# EAGLE design maido_board (EAGLE 6.4)
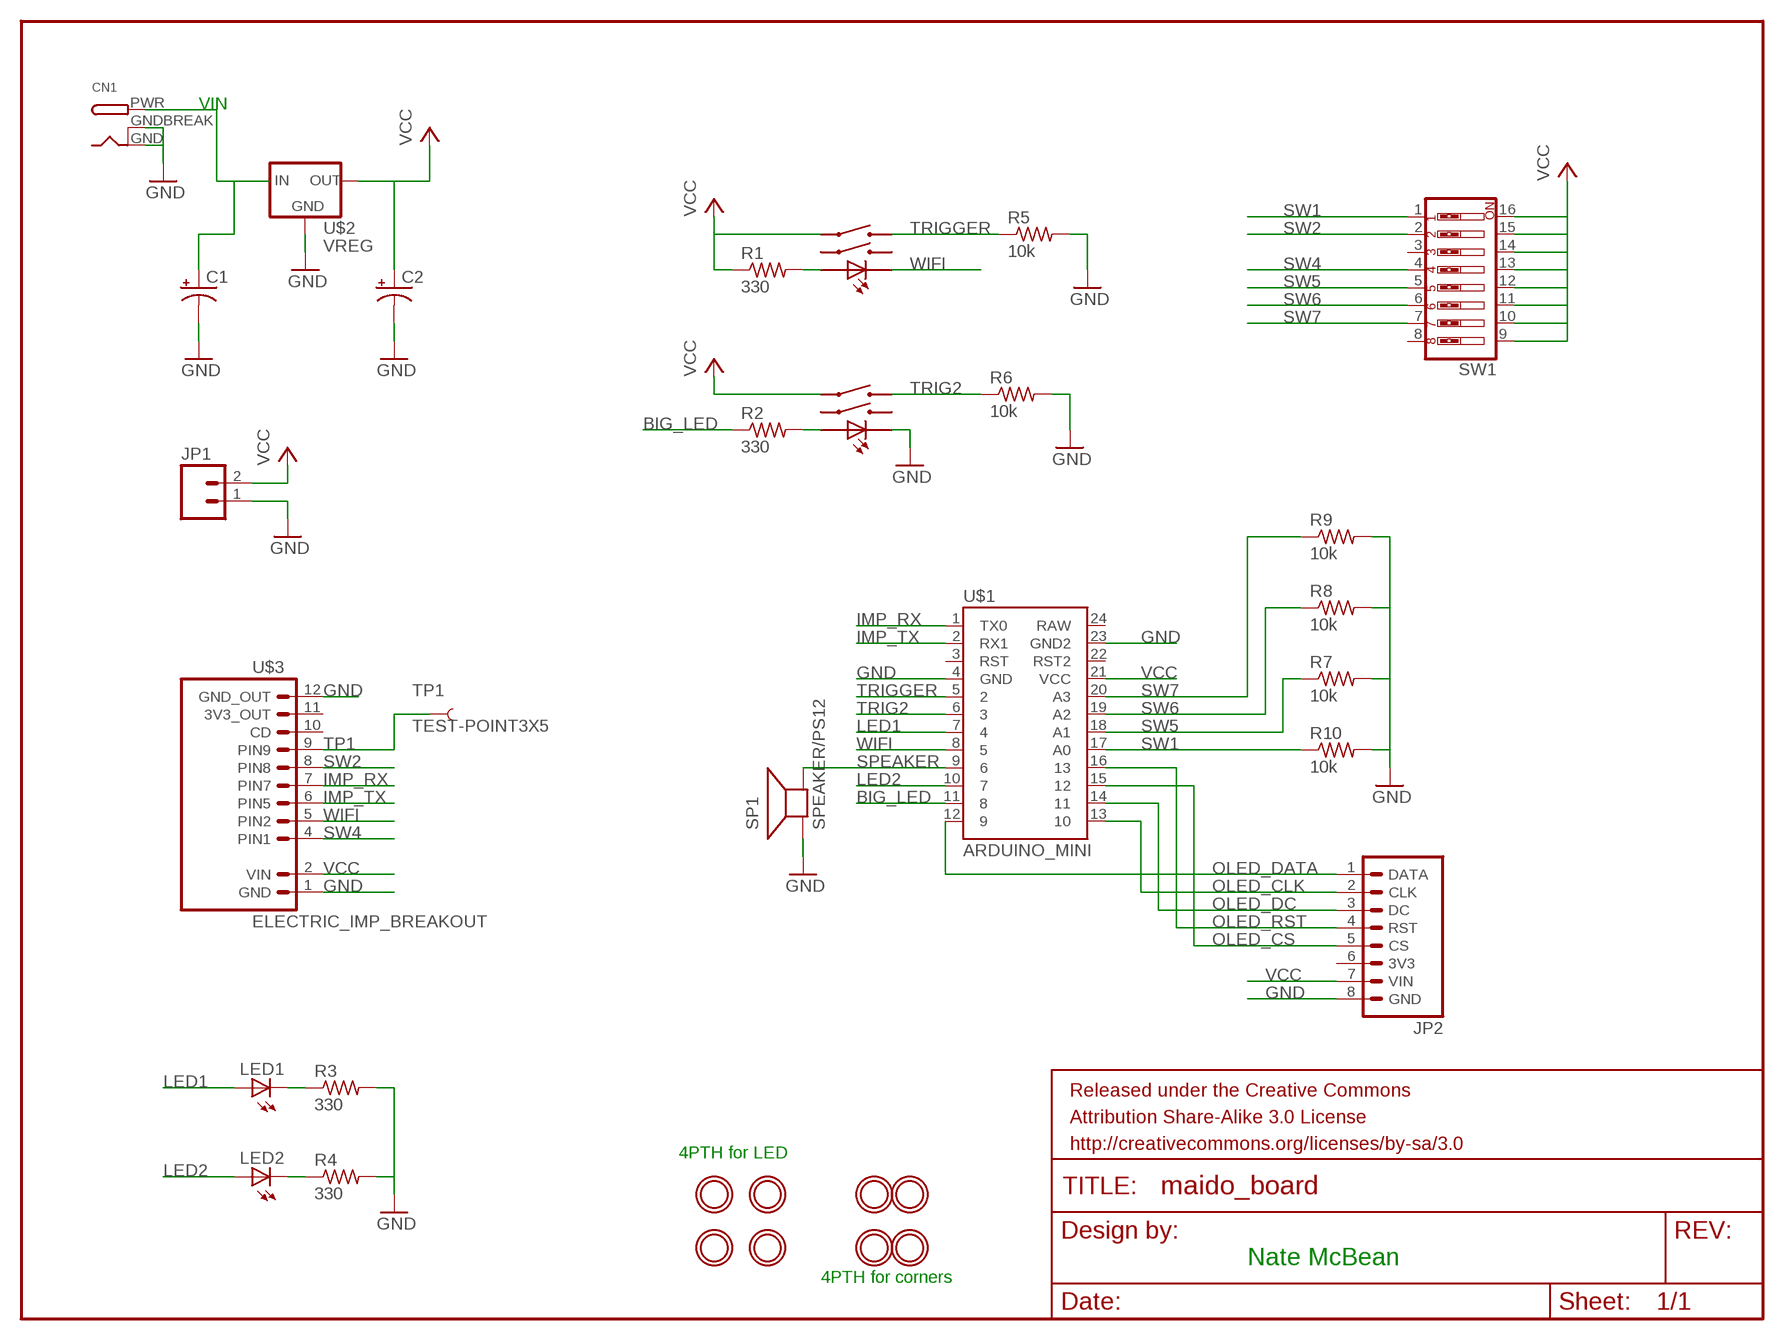
[diagram p0: schematic, sheet 1]

## Parts
ACK  LED_TACTILE_BUTTON  [LED_TACTILE_BUTTON]
C1  CAP_POLPTH2  [CPOL-RADIAL-10UF-25V]
C2  CAP_POLPTH2  [CPOL-RADIAL-10UF-25V]
CN1  DCBARRELPTH  [DCJACK_2MM_PTH]
FRAME1  FRAME-LETTER  [CREATIVE_COMMONS]
JP1  M02PTH  [1X02]
JP2  OLED128X641X08  [OLED_128X64]
LED1  LED5MM  [LED5MM]
LED2  LED5MM  [LED5MM]
R1  330  R-US_R0805  [R0805]
R2  330  R-US_R0805  [R0805]
R3  330  R-US_R0805  [R0805]
R4  330  R-US_R0805  [R0805]
R5  10k  R-US_R0805  [R0805]
R6  10k  R-US_R0805  [R0805]
R7  10k  R-US_R0805  [R0805]
R8  10k  R-US_R0805  [R0805]
R9  10k  R-US_R0805  [R0805]
R10  10k  R-US_R0805  [R0805]
SEND  LED_TACTILE_BUTTON  [LED_TACTILE_BUTTON]
SP1  SPEAKER/PS12  [PS12]
SW1  SW_DIP-8  [DIPSWITCH-08]
TP1  TEST-POINT3X5  [PAD.03X.05]
U$1  ARDUINO_MINI  [ARDUINO_MINI]
U$2  VREG  V_REG_LD1117VXX  [78XXL]
U$3  ELECTRIC_IMP_BREAKOUT  [ELECTRIC_IMP_BREAKOUT]
U$5  MOUNTINGHOLE2.5  [MOUNTINGHOLE_2.5_PLATED]
U$6  MOUNTINGHOLE2.5  [MOUNTINGHOLE_2.5_PLATED]
U$7  MOUNTINGHOLE2.5  [MOUNTINGHOLE_2.5_PLATED]
U$8  MOUNTINGHOLE2.5  [MOUNTINGHOLE_2.5_PLATED]
U$9  MOUNTINGHOLE2.5  [MOUNTINGHOLE_2.5_PLATED]
U$10  MOUNTINGHOLE2.5  [MOUNTINGHOLE_2.5_PLATED]
U$11  MOUNTINGHOLE2.5  [MOUNTINGHOLE_2.5_PLATED]
U$12  MOUNTINGHOLE2.5  [MOUNTINGHOLE_2.5_PLATED]

## Nets
BIG_LED: R2.1 U$1.11
GND: ACK.LEDC C1.2(-) C2.2(-) CN1.GND CN1.GNDBREAK JP1.1 JP2.8(GND) R3.2 R4.2 R5.2 R6.2 R7.2 R8.2 R9.2 R10.2 SP1.P$1(+) U$1.4(GND) U$1.23(GND2) U$2.IN(GND) U$3.1(GND) U$3.12(GND_OUT)
IMP_RX: U$1.1(TX0) U$3.7(PIN7)
IMP_TX: U$1.2(RX1) U$3.6(PIN5)
LED1: LED1.A U$1.7
LED2: LED2.A U$1.10
N$1: R1.2 SEND.LEDA
N$2: ACK.LEDA R2.2
N$3: LED1.K(C) R3.1
N$4: LED2.K(C) R4.1
OLED_CLK: JP2.2(CLK) U$1.13
OLED_CS: JP2.5(CS) U$1.15
OLED_DATA: JP2.1(DATA) U$1.12
OLED_DC: JP2.3(DC) U$1.14
OLED_RST: JP2.4(RST) U$1.16
SPEAKER: SP1.P$2(-) U$1.9
SW1: R10.1 SW1.1 U$1.17(A0)
SW2: SW1.2 U$3.8(PIN8)
SW4: SW1.4 U$3.4(PIN1)
SW5: R7.1 SW1.5 U$1.18(A1)
SW6: R8.1 SW1.6 U$1.19(A2)
SW7: R9.1 SW1.7 U$1.20(A3)
TP1: TP1.P$1 U$3.9(PIN9)
TRIG2: ACK.SWA2 R6.1 U$1.6
TRIGGER: R5.1 SEND.SWA2 U$1.5
VCC: ACK.SWA1 C2.1(+) JP1.2 JP2.7(VIN) R1.1 SEND.SWA1 SW1.9 SW1.10 SW1.11 SW1.12 SW1.13 SW1.14 SW1.15 SW1.16 U$1.21(VCC) U$2.GND(OUT) U$3.2(VIN)
VIN: C1.1(+) CN1.PWR U$2.OUT(IN)
WIFI: SEND.LEDC U$1.8 U$3.5(PIN2)
Unconnected: ACK.SWB1 ACK.SWB2 JP2.6(3V3) SEND.SWB1 SEND.SWB2 SW1.3 SW1.8 U$1.3(RST) U$1.22(RST2) U$1.24(RAW) U$3.10(CD) U$3.11(3V3_OUT)

## Notes on the sheet
- 4PTH for LED
- Nate McBean
- 4PTH for corners

## Library data of the parts
ACK SEND = SparkFun-LED_Tactile_Button:LED_TACTILE_BUTTON: LED Tactile Button Device for SparkFun Electronics' LED Tactile Button. In part derived from BOB-10467 - LED Tactile Button Breakout. Released under the Creative Commons Attribution Share-Alike 3.0 License http://creativecommons.org/licenses/by-sa/3.0 COM-10439 - White COM-10440 - Green COM-10441 - Orange COM-10442 - Red COM-10443 - Blue
C1 C2 = SparkFun-Passives:CAP_POL: Capacitor Polarized These are standard SMD and PTH capacitors. Normally 10uF, 47uF, and 100uF in electrolytic and tantalum varieties. Always verify the external diameter of the through hole cap, it varies with capacity, voltage, and manufacturer. The EIA devices should be standard.
CN1 = adafruit:DCBARREL: 2.0mm DC Barrel Jack DCJACK_2MM_PTH - Through Hole Jack (4UConnector: 05537)
FRAME1 = SparkFun-Aesthetics:FRAME-LETTER: Schematic Frame Standard 8.5x11 US Letter frame
JP1 = SparkFun-Connectors:M02: Header 2 Standard 2-pin 0.1" header. Use with straight break away headers (SKU : PRT-00116), right angle break away headers (PRT-00553), swiss pins (PRT-00743), machine pins (PRT-00117), and female headers (PRT-00115). Molex polarized connector foot print use with SKU : PRT-08233 with associated crimp pins and housings.
JP2 = nate_parts:OLED128X64: Header 8 Standard 8-pin 0.1" header. Use with straight break away headers (SKU : PRT-00116), right angle break away headers (PRT-00553), swiss pins (PRT-00743), machine pins (PRT-00117), and female headers (PRT-00115).
LED1 LED2 = SparkFun-LED:LED: LEDs Standard schematic elements and footprints for 5mm, 3mm, 1206, and 0603 sized LEDs. 5mm - Spark Fun Electronics SKU : COM-00529 (and others)
R1-R10 = adafruit:R-US_: RESISTOR, American symbol
SP1 = adafruit:SPEAKER: SPEAKER Source: Buerklin Added PS12 (for part # PS1240 piezo) http://www.ladyada.net/library/pcb/eaglelibrary.html
SW1 = SparkFun-Electromechanical:SW_DIP-8: DIP Switch 8 Position Spark Fun Electronics SKU : COM-08034
TP1 = SparkFun-Passives:TEST-POINT: Bare copper test points for troubleshooting or ICT
U$1 = SparkFun-Boards:ARDUINO_MINI: Arduino Pro Mini footprint
U$2 = SparkFun-PowerIC:V_REG_LD1117VXX: LD1117VXX voltage regulator. We carry the 3.3V version (COM-00526) in TO-220 package.
U$3 = nate_parts:ELECTRIC_IMP_BREAKOUT: Header 14 Standard 14-pin 0.1" header. Use with straight break away headers (SKU : PRT-00116), right angle break away headers (PRT-00553), swiss pins (PRT-00743), machine pins (PRT-00117), and female headers (PRT-00115).
U$5-U$12 = adafruit_microbuilder:MOUNTINGHOLE: Mounting Hole For #2 screws (0.086"/2.18mm width, 0.094"/2.4mm hole) use 2.5mm

## Board
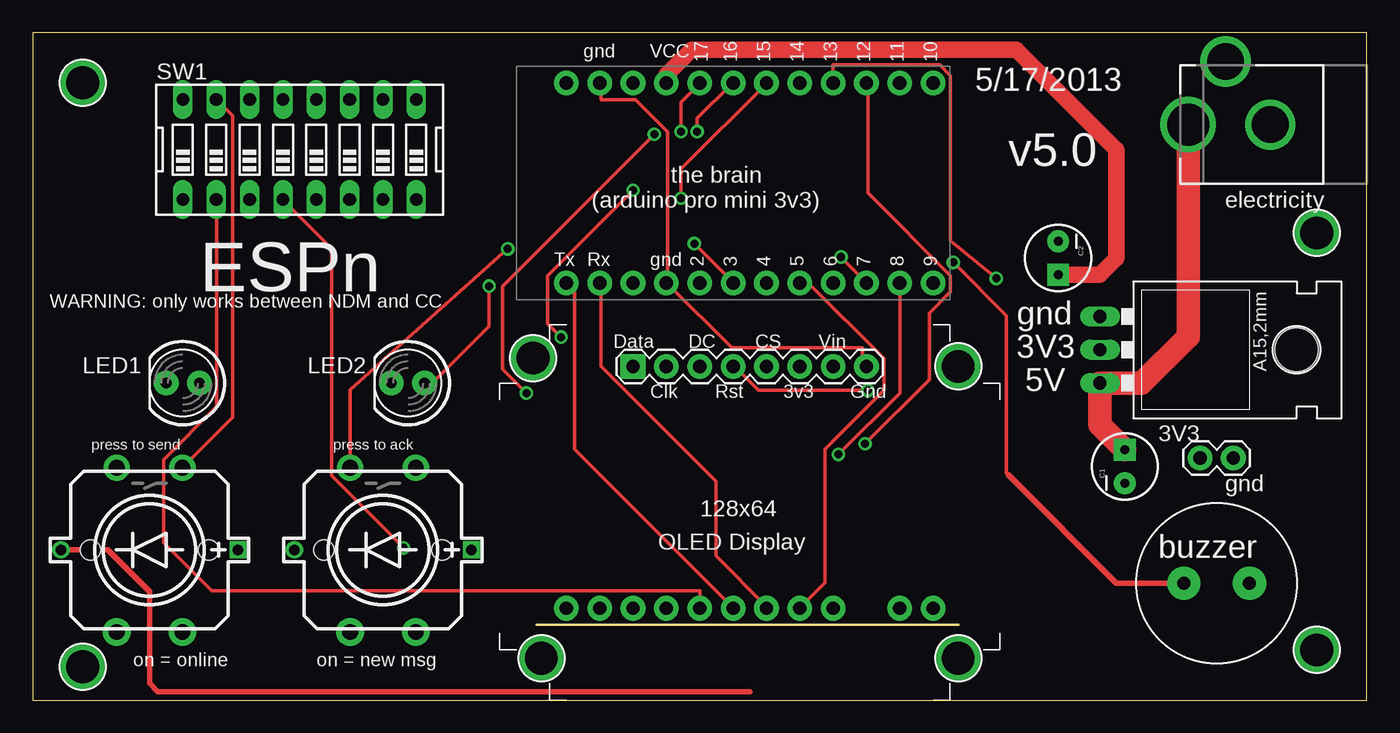
[diagram p1: board, top side]
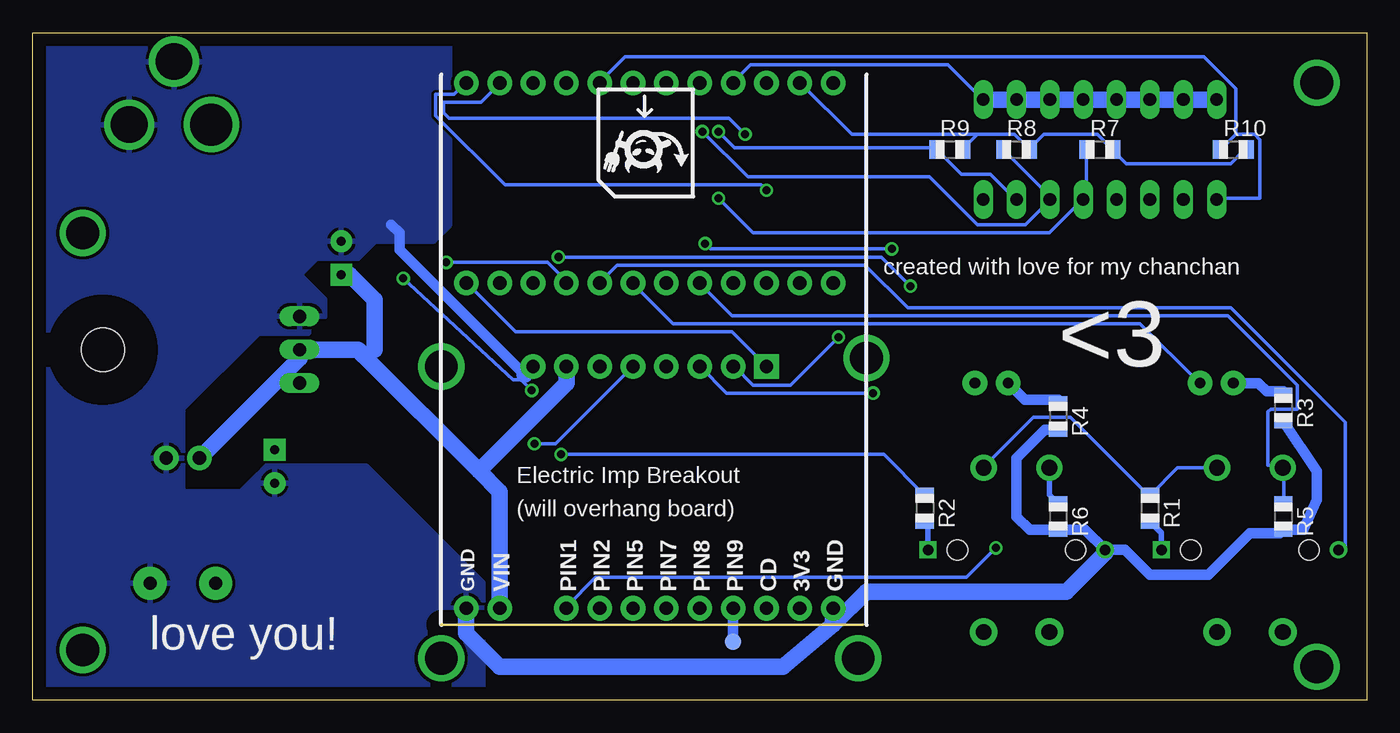
[diagram p2: board, bottom side, seen from below]

Size 101.6 x 50.8 mm. Coordinates in mm from the lower left corner, seen from the top.
Outline: 0,0 101.6,0 101.6,50.8 0,50.8 0,0
Copper layers (1*16): Top 0.035mm / dielectric 1.5mm / Bottom 0.035mm
Design rules "default": minimum track width 10mil, minimum drill 24mil, track to track 8mil, track to pad 8mil, pad to pad 8mil, via to via 8mil, smd to smd 8mil, copper to edge 40mil, drill to drill 8mil, minimum pad ring 10mil, minimum via ring 8mil, stop-mask expansion 4mil, vias tented up to drill 0mil, thermal gap 10mil

### Footprints (pad centres in the part's own frame; a part is rotated, then mirrored left to right if it is on the bottom)
LED_TACTILE_BUTTON = drill 0.8 square: LEDA -6.75,0 | drill 0.8: LEDC 6.75,0 | drill 1.2 pad 2: SWA1 -2.5,-6.25; SWA2 2.5,-6.25 | drill 1.2 pad 2.1: SWB1 -2.5,6.25; SWB2 2.5,6.25 | hole 1.55: -4.5,0; 4.5,0
CPOL-RADIAL-10UF-25V = drill 0.7 pad 1.651 square: 1 1.27,0 | drill 0.7 pad 1.651: 2 -1.27,0
DCJACK_2MM_PTH = drill 2.8: GND 0,7.35; GNDBREAK 4.8,10.75 | drill 3.2: PWR 0,13.6
1X02 = drill 1.016 pad 1.88: 1 0,0; 2 2.54,0
OLED_128X64 = drill 1.016 pad 1.88 square: 1 10.16,25.4 | drill 1.016 pad 1.88: 2 12.7,25.4; 3 15.24,25.4; 4 17.78,25.4; 5 20.32,25.4; 6 22.86,25.4; 7 25.4,25.4; 8 27.94,25.4
LED5MM = drill 0.813 pad 1.88: A -1.27,0; K 1.27,0
R0805 = smd 1.1 x 1.4: 1 -1,0; 2 1,0
PS12 = drill 1 pad 2.54: P$1 -2.5,0; P$2 2.5,0
DIPSWITCH-08 = drill 0.97 long: 1 -8.89,-3.81; 2 -6.35,-3.81; 3 -3.81,-3.81; 4 -1.27,-3.81; 5 1.27,-3.81; 6 3.81,-3.81; 7 6.35,-3.81; 8 8.89,-3.81; 9 8.89,3.81; 10 6.35,3.81; 11 3.81,3.81; 12 1.27,3.81; 13 -1.27,3.81; 14 -3.81,3.81; 15 -6.35,3.81; 16 -8.89,3.81
PAD.03X.05 = smd 1.27 x 1.27: P$1 0,0
ARDUINO_MINI = drill 1.016 pad 1.88: 1 -7.62,12.7; 2 -7.62,10.16; 3 -7.62,7.62; 4 -7.62,5.08; 5 -7.62,2.54; 6 -7.62,0; 7 -7.62,-2.54; 8 -7.62,-5.08; 9 -7.62,-7.62; 10 -7.62,-10.16; 11 -7.62,-12.7; 12 -7.62,-15.24; 13 7.62,-15.24; 14 7.62,-12.7; 15 7.62,-10.16; 16 7.62,-7.62; 17 7.62,-5.08; 18 7.62,-2.54; 19 7.62,0; 20 7.62,2.54; 21 7.62,5.08; 22 7.62,7.62; 23 7.62,10.16; 24 7.62,12.7
78XXL = drill 1.016 long: GND 0,-3.81; IN -2.54,-3.81; OUT 2.54,-3.81 | hole 3.302: 0,11.176
ELECTRIC_IMP_BREAKOUT = drill 1.016 pad 1.88: 1 1.905,1.27; 2 4.445,1.27; 4 9.525,1.27; 5 12.065,1.27; 6 14.605,1.27; 7 17.145,1.27; 8 19.685,1.27; 9 22.225,1.27; 10 24.765,1.27; 11 27.305,1.27; 12 29.845,1.27
MOUNTINGHOLE_2.5_PLATED = drill 2.5 pad 3.2: P$1 0,0

### Placement (x,y rotation side)
ACK  26.67,11.43 180 top
C1  83.19,17.78 90 top
C2  78.11,33.66 270 top
CN1  101.6,43.81 90 top
FRAME1  16.51,-12.7 0 top  (outside the outline)
JP1  91.44,18.41 180 top
JP2  35.56,0 0 top
LED1  11.43,24.13 180 top
LED2  28.57,24.13 180 top
R1  16.51,14.61 270 bottom
R2  33.66,14.61 270 bottom
R3  6.35,22.23 270 bottom
R4  23.5,21.59 270 bottom
R5  6.35,13.97 270 bottom
R6  23.5,13.97 270 bottom
R7  20.32,41.91 0 bottom
R8  26.67,41.91 0 bottom
R9  31.75,41.91 0 bottom
R10  10.16,41.91 0 bottom
SEND  8.89,11.43 180 top
SP1  90.17,8.89 180 top
SW1  20.32,41.91 0 top
TP1  48.26,4.45 0 bottom
U$1  53.34,39.37 90 top
U$2  85.09,26.67 270 top
U$3  70.48,5.71 0 bottom
U$5  70.48,3.17 0 top
U$6  70.48,25.4 0 top
U$7  3.81,46.99 0 top
U$8  38.73,3.17 0 top
U$9  38.1,26.04 0 top
U$10  97.79,35.56 0 top
U$11  3.81,2.54 0 top
U$12  97.79,3.81 0 top

### Tracks (layer width: path | path; a pad name or v marks a point on that pad's centre or on a via)
BIG_LED  (via drill 0.61)
  Top 0.254: v61.37,18.69 66.04,23.37 U$1.11
  Bottom 0.254: v61.37,18.69 36.78,18.69 33.73,15.65 R2.1
GND
  Top 0.254: JP2.8 63.4,25.4 63.2,25.6 63.2,26.82 53.24,26.82 48.36,31.7 U$1.4 48.36,31.9 48.36,43.28 45.92,45.72 43.28,45.72 43.28,46.94 U$1.23
  Bottom 0.254: 29.67,43.08 26.82,43.08 25.81,42.06 R8.2 25.6,42.06 24.59,43.08 20.52,43.08 19.51,42.06 R7.2 19.3,41.86 18.29,40.84 10.36,40.84 9.35,41.86 R10.2 | 29.67,43.08 30.68,42.06 R9.2 | 29.67,43.08 39.22,43.08 43.08,46.94 U$1.23
  Bottom 0.813: 64.14,24.77 73.66,34.29 73.66,35.56 74.3,36.2 | R3.2 3.81,17.41 3.81,15.24 4.81,12.97 R5.2 6.62,12.7 8.89,12.7 12.06,9.53 16.51,9.53 18.41,11.43 ACK.LEDC 21.46,12.97 R6.2 25.67,12.97 26.67,13.97 26.67,18.41 24.5,20.59 R4.2
  Bottom 1.27: JP2.8 64.14,24.77 | U$3.12 40.64,5.71 | 40.64,5.71 44.45,2.54 66.04,2.54 68.58,5.08 U$3.1 | ACK.LEDC 19.92,11.2 22.86,8.26 38.1,8.26 40.64,5.71
  pour Bottom: 87.63,50.8 87.63,47.62 91.44,43.81 91.44,34.92 88.9,32.38 81.28,32.38 80.01,31.11 79.38,30.48 79.38,29.21 80.01,28.57 80.64,27.94 84.45,27.94 90.17,22.23 90.17,6.99 88.27,5.08 79.38,5.08 78.74,5.08 74.3,9.53 69.22,9.53 68.58,9.53 67.31,8.26 67.31,5.08 67.31,0 101.6,0 101.6,50.8
  pour Bottom: 81.28,32.38 80.01,33.66 76.83,33.66 75.56,34.92 75.56,36.83 76.83,38.1 89.53,38.1 91.44,40.01 93.98,40.01 93.98,32.38
  pour Bottom: 90.81,15.88 85.72,15.88 84.45,17.14 83.82,17.78 82.55,17.78 81.92,17.78 81.28,17.14 81.28,15.24 82.55,13.97 87,13.97 90.17,10.79
  pour Bottom: 76.2,34.29 75.56,34.92 71.12,34.92 69.85,36.2 69.85,50.8 101.6,50.8 101.6,31.11 82.55,31.11 80.64,33.02 78.74,34.92
  pour Bottom: 67.31,8.26 67.31,8.89 71.12,12.7 74.93,16.51 76.2,17.78 82.55,17.78 82.55,14.61 88.27,14.61 93.34,9.53 93.34,3.81 74.3,3.81 70.48,7.62 68.58,9.53
IMP_RX
  Top 0.254: U$3.7 53.24,7.11 41.25,19.1 41.25,31.09 40.64,31.7 U$1.1
IMP_TX
  Top 0.254: U$3.6 55.88,7.11 52.02,10.97 52.02,16.66 43.28,25.4 43.28,31.7 U$1.2
LED1
  Bottom 0.254: LED1.A 12.8,24.18 17.27,28.65 52.83,28.65 55.88,31.7 U$1.7
LED2  (via drill 0.61)
  Top 0.254: v34.75,31.52 34.75,28.45 29.87,23.57 LED2.A | v61.57,33.73 63.4,31.9 U$1.10
  Bottom 0.254: v34.75,31.52 36.96,33.73 v61.57,33.73
N$1
  Bottom 0.406: SEND.LEDA 15.64,12.73 R1.2
N$2
  Bottom 0.406: ACK.LEDA 33.42,13.37 R2.2
N$3
  Bottom 0.406: 6.35,23.5 R3.1
  Bottom 0.813: LED1.K 8.26,24.13 7.62,23.5 6.35,23.5
N$4
  Bottom 0.406: 23.5,22.86 R4.1
  Bottom 0.813: LED2.K 26.04,22.86 23.5,22.86
OLED_CLK  (via drill 0.61)
  Top 0.254: v40.23,27.64 39.22,28.65 39.22,32.31 v45.72,38.81
  Bottom 0.254: v40.23,27.64 43.89,23.98 46.74,23.98 48.16,25.4 JP2.2 | v45.72,38.81 46.13,39.22 65.63,39.22 70.92,44.5 70.92,46.13 69.49,46.13 68.68,46.94 U$1.13
OLED_CS  (via drill 0.61)
  Top 0.254: v63.4,19.51 68.28,24.38 68.28,29.46 69.9,31.09 69.9,32.31 63.6,38.61 63.6,46.94 U$1.15
  Bottom 0.254: JP2.5 61.77,19.51 v63.4,19.51
OLED_DATA
  Bottom 0.254: JP2.1 48.36,28.04 64.82,28.04 68.48,31.7 U$1.12
OLED_DC  (via drill 0.61)
  Top 0.254: v37.59,23.37 35.76,25.2 35.76,31.5 v47.35,43.08
  Bottom 0.254: JP2.3 48.77,23.37 v37.59,23.37 | v47.35,43.08 48.56,44.3 69.9,44.3 70.31,44.7 70.31,45.52 67.46,45.52 66.04,46.94 U$1.14
OLED_RST  (via drill 0.61)
  Top 0.254: v63.6,23.57 55.27,23.57 53.44,25.4 JP2.4 | v73.38,32.11 69.9,34.95 69.9,47.55 69.09,48.36 60.96,48.36 U$1.16
  Bottom 0.254: v63.6,23.57 64.41,24.38 65.02,24.38 v73.38,32.11
SPEAKER  (via drill 0.61)
  Top 0.254: v70.1,33.33 74.17,29.26 74.17,17.27 74.3,17.14
  Top 0.406: SP1.P$2 82.55,8.89 74.3,17.14
  Bottom 0.254: v70.1,33.33 62.38,33.33 60.96,31.9 U$1.9
SW1
  Bottom 0.254: 9.96,43.08 10.97,42.06 R10.1 | 9.96,43.08 8.53,43.08 8.13,42.67 8.13,38.2 11.38,38.2 SW1.1 | 9.96,43.08 9.96,46.53 12.39,48.97 56.49,48.97 58.32,47.14 U$1.17
SW2
  Top 0.254: U$3.8 50.8,8.33 13.61,8.33 9.96,11.99 9.96,18.29 14.02,22.35 14.02,38 SW1.2
SW4  (via drill 0.61)
  Top 0.254: v28.25,11.58 22.76,17.07 22.76,34.34 19.1,38 SW1.4
  Bottom 0.254: v28.25,11.58 30.48,9.35 58.73,9.35 60.96,7.11 U$3.4
SW5  (via drill 0.61)
  Top 0.254: v49.38,38.2 49.38,40.44 55.88,46.94 U$1.18
  Bottom 0.254: R7.1 21.34,41.86 21.34,38.2 21.54,38.2 SW1.5 21.74,38 24.18,35.56 46.74,35.56 v49.38,38.2
SW6  (via drill 0.61)
  Top 0.254: v50.6,43.28 50.6,44.3 53.24,46.94 U$1.19
  Bottom 0.254: R8.1 27.64,41.86 23.98,38.2 SW1.6 24.18,38 26.01,36.17 29.67,36.17 33.33,39.83 47.14,39.83 v50.6,43.28
SW7  (via drill 0.61)
  Top 0.254: v49.38,43.28 49.38,45.52 50.8,46.94 U$1.20
  Bottom 0.254: SW1.7 26.82,38.2 28.65,40.03 30.89,40.03 32.72,41.86 R9.1 32.92,42.06 48.16,42.06 v49.38,43.28
TP1
  Bottom 0.813: TP1.P$1 U$3.9
TRIG2  (via drill 0.61)
  Top 0.254: v50.39,34.75 53.24,31.9 U$1.6 | v36.17,34.34 24.18,23.62 24.18,17.88 ACK.SWA2
  Bottom 0.254: v50.39,34.75 49.99,34.34 v36.17,34.34
  Bottom 0.406: ACK.SWA2 24.17,15.64 R6.1
TRIGGER
  Bottom 0.254: R5.1 6.3,15.04 6.3,17.68 SEND.SWA2 6.5,17.88 7.52,17.88 7.52,21.95 7.32,22.15 5.28,22.15 5.28,23.98 10.57,29.26 48.36,29.26 50.8,31.7 U$1.5
VCC
  Top 0.254: SEND.SWA1 11.58,17.88 15.24,21.54 15.24,44.5 14.02,45.72 SW1.15
  Top 1.27: U$1.21 48.26,47.62 50.16,49.53 74.93,49.53 82.55,41.91 82.55,33.66 81.28,32.38 C2.1
  Bottom 0.254: SEND.SWA1 11.58,17.68 14.43,17.68 16.46,15.65 R1.1 16.66,15.65 22.55,21.54 25.4,21.54 29.06,17.88 ACK.SWA1 | SW1.9 29.67,46.13 31.9,48.36 46.94,48.36 48.16,47.14 U$1.21 | 75.56,26.67 76,26.62 76.39,26.23
  Bottom 1.27: JP1.2 81.28,26.04 U$2.GND 76.83,26.67 76.39,26.23 67.63,17.46 | 67.63,17.46 66.04,15.88 U$3.2 | JP2.7 60.96,24.13 67.63,17.46 | C2.1 77.47,32.38 75.56,30.48 75.56,26.67 | SW1.16 SW1.15 SW1.14 SW1.13 SW1.12 SW1.11 SW1.10 SW1.9
VIN
  Top 1.778: CN1.PWR 88,27.68 84.45,24.13 U$2.OUT 81.28,20.95 C1.1
WIFI
  Top 0.254: U$3.5 58.52,7.11 60.35,8.94 60.35,19.1 64.82,23.57 64.82,26.01 59.13,31.7 58.52,31.7 U$1.8
  Top 0.406: 54.61,0.64 9.53,0.64 8.89,1.27 8.89,8.26 5.71,11.43 SEND.LEDC
  Bottom 0.254: U$1.8 58.32,31.9 57.1,33.12 38.2,33.12 34.95,29.87 10.36,29.87 1.63,21.13 1.63,11.58 2.03,11.58 SEND.LEDC

### Text on the board
tPlace: gnd | VCC | 17 | 16 | 15 | 14 | 13 | 12 | 11 | 10 | 5/17/2013 | v5.0 | the brain | (arduino pro mini 3v3) | electricity | Tx | Rx | gnd | 2 | 3 | 4 | 5 | 6 | 7 | 8 | 9 | ESPn | WARNING: only works between NDM and CC | gnd | 3V3 | 5V | 3V3 | press to send | press to ack | gnd | buzzer | on = online | on = new msg
bPlace: created with love for my chanchan | <3 | love you!